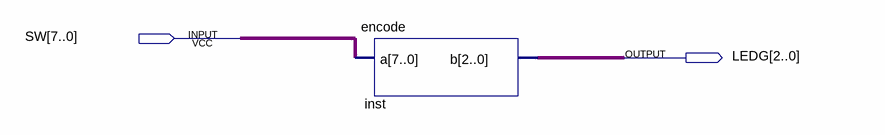
[diagram p0: schematic sheet]
// Quartus schematic encoder8to3.bdf as structural Verilog: 1 symbols, 2 pins
module encoder8to3 (
  input  [7:0] SW,
  output [2:0] LEDG
);

  encode inst (.a(SW), .b(LEDG));
endmodule
